# EAGLE design 7 segment driver (EAGLE 5.12)
DATABASE: ../../partsdb.txt
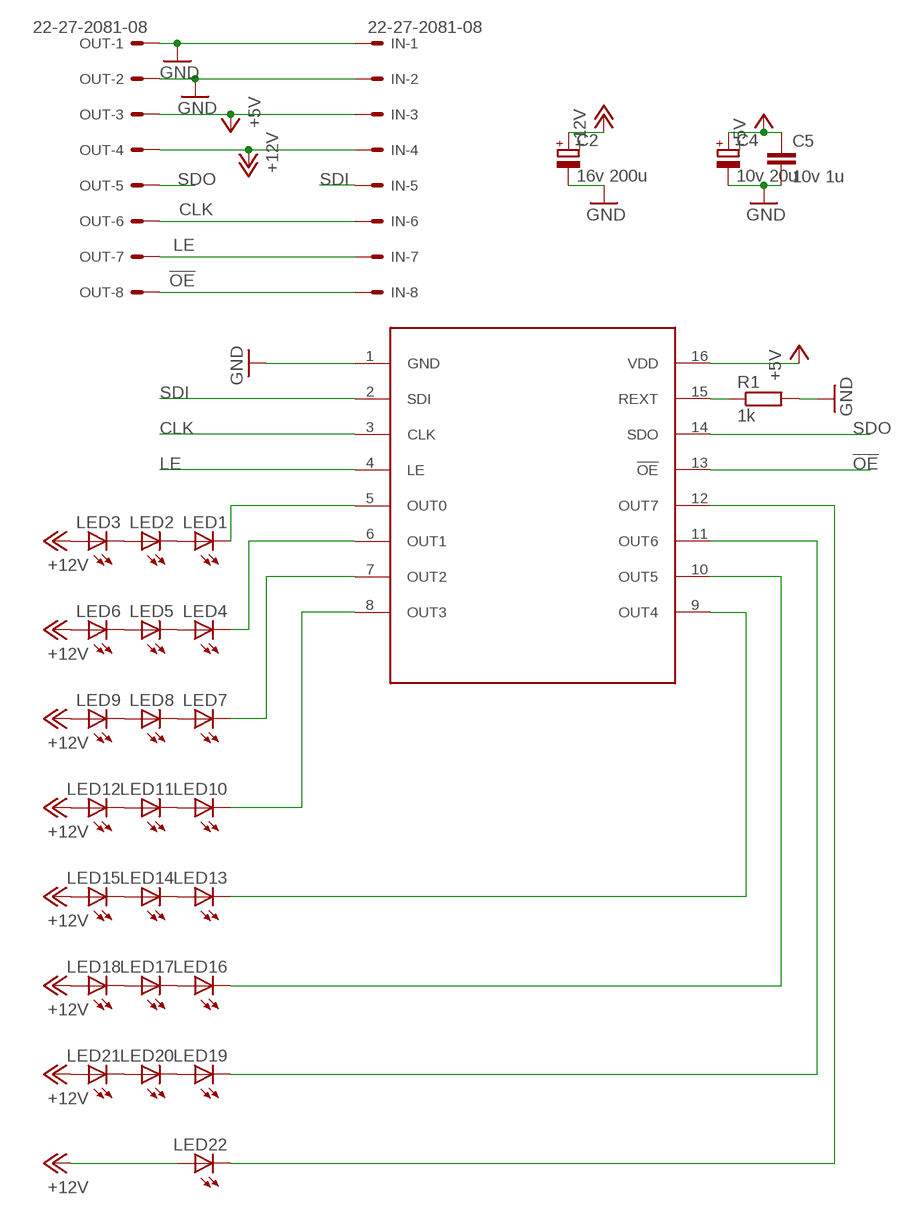
[diagram p0: schematic, sheet 1]

## Parts
C2  16v 200u  CPOL-EUE5-6  [E5-6]
C4  10v 20u  CPOL-EUE1.8-4  [E1,8-4]
C5  10v 1u  C-EU025-025X050  [C025-025X050]
IC1  TLC5916  [DIL16]
IN  22-27-2081-08  [6410-08]
LED1  LED10MM  [LED10MM]
LED2  LED10MM  [LED10MM]
LED3  LED10MM  [LED10MM]
LED4  LED10MM  [LED10MM]
LED5  LED10MM  [LED10MM]
LED6  LED10MM  [LED10MM]
LED7  LED10MM  [LED10MM]
LED8  LED10MM  [LED10MM]
LED9  LED10MM  [LED10MM]
LED10  LED10MM  [LED10MM]
LED11  LED10MM  [LED10MM]
LED12  LED10MM  [LED10MM]
LED13  LED10MM  [LED10MM]
LED14  LED10MM  [LED10MM]
LED15  LED10MM  [LED10MM]
LED16  LED10MM  [LED10MM]
LED17  LED10MM  [LED10MM]
LED18  LED10MM  [LED10MM]
LED19  LED10MM  [LED10MM]
LED20  LED10MM  [LED10MM]
LED21  LED10MM  [LED10MM]
LED22  LED10MM  [LED10MM]
OUT  22-27-2081-08  [6410-08]
R1  1k  R-EU_0207/10  [0207/10]

## Nets
!OE: IC1.13(!OE) IN.8 OUT.8
+5V [power]: C4.+ C5.1 IC1.16(VDD) IN.3 OUT.3
+12V [power]: C2.+ IN.4 LED3.A LED6.A LED9.A LED12.A LED15.A LED18.A LED21.A LED22.A OUT.4
CLK: IC1.3(CLK) IN.6 OUT.6
GND [power]: C2.- C4.- C5.2 IC1.1(GND) IN.1 IN.2 OUT.1 OUT.2 R1.2
LE: IC1.4(LE) IN.7 OUT.7
N$1: LED1.A LED2.K(C)
N$2: LED2.A LED3.K(C)
N$3: LED4.A LED5.K(C)
N$4: LED5.A LED6.K(C)
N$5: LED7.A LED8.K(C)
N$6: LED8.A LED9.K(C)
N$7: LED10.A LED11.K(C)
N$8: LED11.A LED12.K(C)
N$9: LED13.A LED14.K(C)
N$10: LED14.A LED15.K(C)
N$11: LED16.A LED17.K(C)
N$12: LED17.A LED18.K(C)
N$13: LED19.A LED20.K(C)
N$14: LED20.A LED21.K(C)
N$15: IC1.5(OUT0) LED1.K(C)
N$16: IC1.6(OUT1) LED4.K(C)
N$17: IC1.7(OUT2) LED7.K(C)
N$18: IC1.8(OUT3) LED10.K(C)
N$19: IC1.9(OUT4) LED13.K(C)
N$20: IC1.10(OUT5) LED16.K(C)
N$21: IC1.11(OUT6) LED19.K(C)
N$22: IC1.12(OUT7) LED22.K(C)
N$23: IC1.15(REXT) R1.1
SDI: IC1.2(SDI) IN.5
SDO: IC1.14(SDO) OUT.5

## Library data of the parts
C2 C4 = matt rcl:CPOL-EU: POLARIZED CAPACITOR, European symbol
C5 = matt rcl:C-EU: CAPACITOR, European symbol
IC1 = matt:TLC5916
IN OUT = con-molex:22-?-08: CONNECTOR wire to board 2.54 mm (.1 inch) pitch header; OC_FARNELL: unknown; OC_NEWARK: unknown
LED1-LED22 = led:LED: LED OSRAM: - CHIPLED LG R971, LG N971, LY N971, LG Q971, LY Q971, LO R971, LY R971 LH N974, LH R974 LS Q976, LO Q976, LY Q976 LO Q996 - Hyper CHIPLED LW Q18S LB Q993, LB Q99A, LB R99A - SideLED LS A670, LO A670, LY A670, LG A670, LP A670 LB A673, LV A673, LT A673, LW A673 LH A674 LY A675 LS A676, LA A676, LO A676, LY A676, LW A676 LS A679, LY A679, LG A679 - Hyper Micro SIDELED® LS Y876, LA Y876, LO Y876, LY Y876 LT Y87S - SmartLED LW L88C, LW L88S LB L89C, LB L89S, LG L890 LS L89K, LO L89K, LY L89K LS L896, LA L896, LO L896, LY L896 - TOPLED LS T670, LO T670, LY T670, LG T670, LP T670 LSG T670, LSP T670, LSY T670, LOP T670, LYG T670 LG T671, LOG T671, LSG T671 LB T673, LV T673, LT T673, LW T673 LH T674 LS T676, LA T676, LO T676, LY T676, LB T676, LH T676, LSB T676, LW T676 LB T67C, LV T67C, LT T67C, LS T67K, LO T67K, LY T67K, LW E67C LS E67B, LA E67B, LO E67B, LY E67B, LB E67C, LV E67C, LT E67C LW T67C LS T679, LY T679, LG T679 LS T770, LO T770, LY T770, LG T770, LP T770 LB T773, LV T773, LT T773, LW T773 LH T774 LS E675, LA E675, LY E675, LS T675 LS T776, LA T776, LO T776, LY T776, LB T776 LHGB T686 LT T68C, LB T68C - Hyper Mini TOPLED® LB M676 - Mini TOPLED Santana® LG M470 LS M47K, LO M47K, LY M47K Source: http://www.osram.convergy.de LUXEON: - LUMILED® LXK2-PW12-R00, LXK2-PW12-S00, LXK2-PW14-U00, LXK2-PW14-V00 LXK2-PM12-R00, LXK2-PM12-S00, LXK2-PM14-U00 LXK2-PE12-Q00, LXK2-PE12-R00, LXK2-PE12-S00, LXK2-PE14-T00, LXK2-PE14-U00 LXK2-PB12-K00, LXK2-PB12-L00, LXK2-PB12-M00, LXK2-PB14-N00, LXK2-PB14-P00, LXK2-PB14-Q00 LXK2-PR12-L00, LXK2-PR12-M00, LXK2-PR14-Q00, LXK2-PR14-R00 LXK2-PD12-Q00, LXK2-PD12-R00, LXK2-PD12-S00 LXK2-PH12-R00, LXK2-PH12-S00 LXK2-PL12-P00, LXK2-PL12-Q00, LXK2-PL12-R00 Source: www.luxeon.com KINGBRIGHT: KA-3528ASYC Source: www.kingbright.com
R1 = matt rcl:R-EU_: RESISTOR, European symbol

## Net classes
1 power: width 0.508 mm

## Board
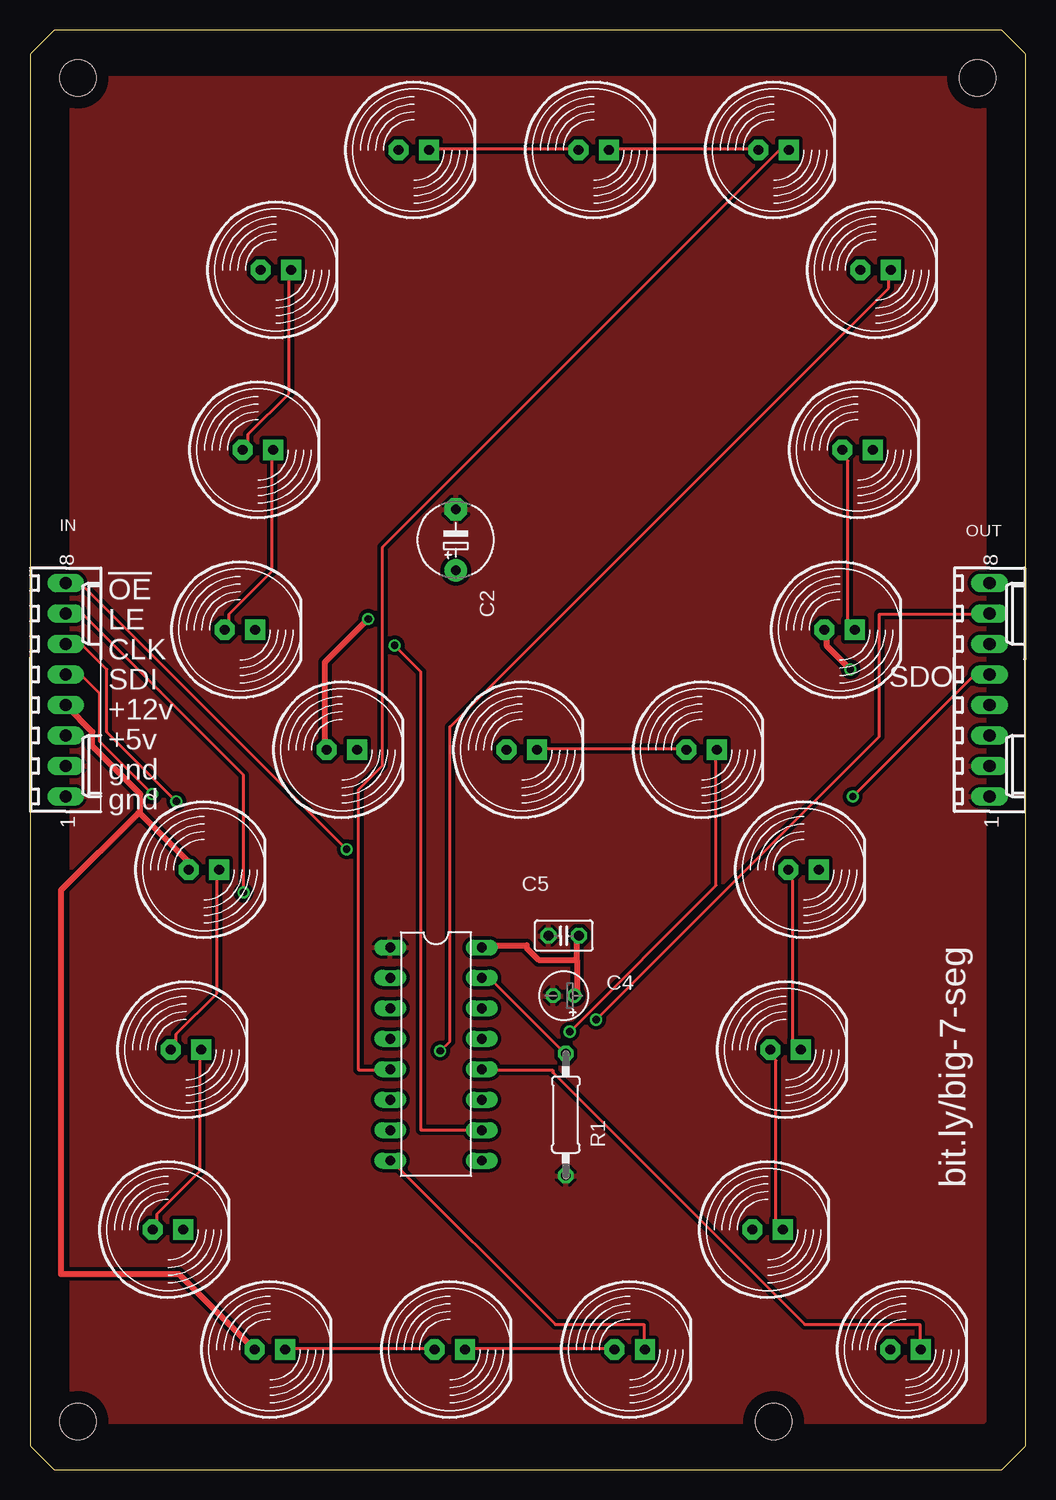
[diagram p1: board, top side]
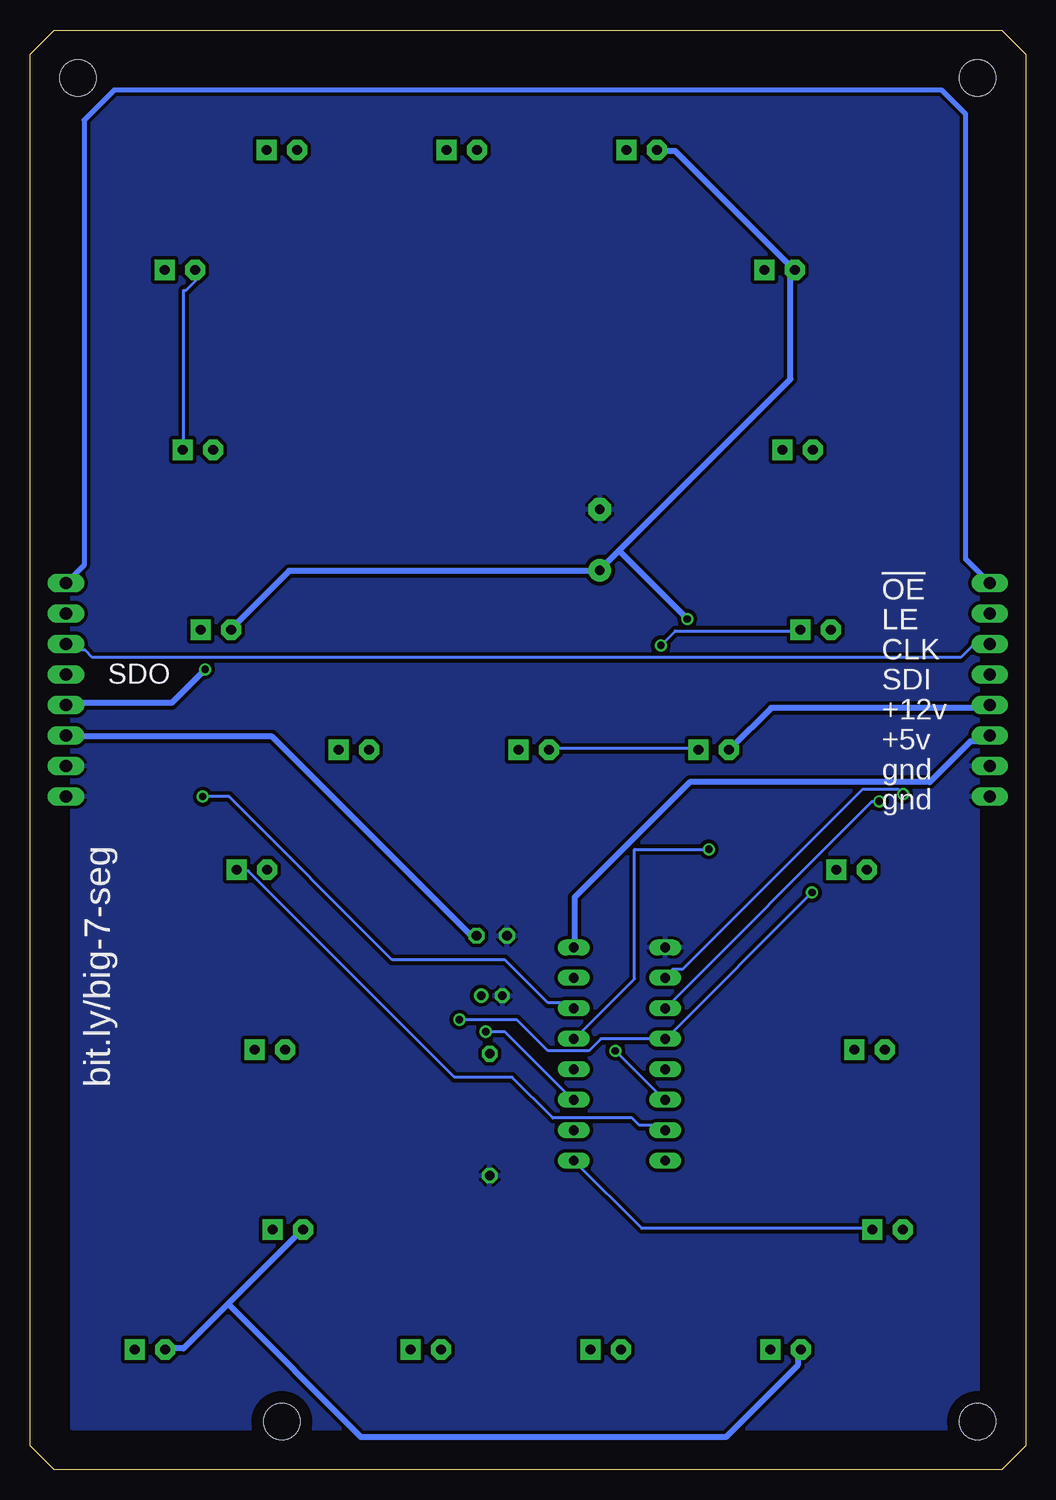
[diagram p2: board, bottom side, seen from below]

Size 83 x 120 mm. Coordinates in mm from the lower left corner, seen from the top.
Outline: 81,0 83,2 83,118 81,120 2,120 0,118 0,2 2,0 81,0
Copper layers (1*16): Top 0.035mm / dielectric 1.5mm / Bottom 0.035mm
Design rules "default": minimum track width 10mil, minimum drill 24mil, track to track 8mil, track to pad 8mil, pad to pad 8mil, via to via 8mil, smd to smd 8mil, copper to edge 40mil, drill to drill 8mil, minimum pad ring 10mil, minimum via ring 8mil, stop-mask expansion 4mil, vias tented up to drill 0mil, thermal gap 10mil
Holes 3 mm at 4,4 62,4 4,116 79,116

### Footprints (pad centres in the part's own frame; a part is rotated, then mirrored left to right if it is on the bottom)
E5-6 = drill 0.813 pad 1.905 round: + -2.54,0 | drill 0.813 pad 1.905 octagon: - 2.54,0
E1,8-4 = drill 0.711 pad 1.168 round: + -0.889,0 | drill 0.711 pad 1.168 octagon: - 0.889,0
C025-025X050 = drill 0.813 octagon: 1 -1.27,0; 2 1.27,0
DIL16 = drill 0.813 long: 1 -8.89,-3.81; 2 -6.35,-3.81; 3 -3.81,-3.81; 4 -1.27,-3.81; 5 1.27,-3.81; 6 3.81,-3.81; 7 6.35,-3.81; 8 8.89,-3.81; 9 8.89,3.81; 10 6.35,3.81; 11 3.81,3.81; 12 1.27,3.81; 13 -1.27,3.81; 14 -3.81,3.81; 15 -6.35,3.81; 16 -8.89,3.81
6410-08 = drill 1.016 long: 1 8.89,0; 2 6.35,0; 3 3.81,0; 4 1.27,0; 5 -1.27,0; 6 -3.81,0; 7 -6.35,0; 8 -8.89,0
LED10MM = drill 0.813 pad 1.676 octagon: A -1.27,0 | drill 0.813 pad 1.676 square: K 1.27,0
0207/10 = drill 0.813 octagon: 1 -5.08,0; 2 5.08,0

### Placement (x,y rotation side)
C2  35.5,77.5 90 top
C4  44.5,39.5 180 top
C5  44.5,44.5 180 top
IC1  33.85,34.63 270 top
IN  2.98,65 270 top
LED1  62,110 0 top
LED2  47,110 0 top
LED3  32,110 0 top
LED4  70.5,100 0 top
LED5  69,85 0 top
LED6  67.5,70 0 top
LED7  64.5,50 0 top
LED8  63,35 0 top
LED9  61.5,20 0 top
LED10  50,10 0 top
LED11  35,10 0 top
LED12  20,10 0 top
LED13  11.5,20 0 top
LED14  13,35 0 top
LED15  14.5,50 0 top
LED16  17.5,70 0 top
LED17  19,85 0 top
LED18  20.5,100 0 top
LED19  56,60 0 top
LED20  41,60 0 top
LED21  26,60 0 top
LED22  73,10 0 top
OUT  80,65 270 top
R1  44.67,29.58 270 top
U$2  [OPENHARDWARELOGO]  53.5,80 90 top

### Tracks (layer width: path | path; a pad name or v marks a point on that pad's centre or on a via)
!OE  (via drill 0.61)
  Top 0.254: v26.4,51.7 4.4,73.7 3,73.7 IN.8
  Bottom 0.254: v26.4,51.7 32.6,51.7 32.6,40.9 37.6,35.9 IC1.13
  Bottom 0.406: IN.8 3,73.89 5,75.89 5,113 7,115 76,115 78.5,112.5 78.5,75.39 OUT.8
+5V
  Top 0.508: 45.6,42.5 45.6,44.5 C5.1 | 45.6,42.5 45.6,39.7 C4.+ | IC1.16 37.8,43.7 41.4,43.7 41.4,43.5 42.4,42.5 45.6,42.5
  Bottom 0.508: IN.3 3,61.1 3.4,60.7 4.6,60.7 8,57.3 28,57.3 37.6,47.7 37.6,43.7 IC1.16 | OUT.3 80,61.1 62.8,61.1 46.2,44.5 C5.1
+12V  (via drill 0.61)
  Top 0.508: v68.4,66.7 66.4,68.7 66.4,69.9 LED6.A | 9.2,54.7 9.2,56.3 5.2,60.3 5.2,61.5 3,63.7 IN.4 | 9.2,54.7 13.2,50.7 13.2,50.1 LED15.A | LED12.A 18.6,10.1 12.4,16.3 2.6,16.3 2.6,48.3 9,54.7 9.2,54.7 | v28.2,70.9 24.6,67.3 24.6,60.1 LED21.A
  Bottom 0.508: v68.4,66.7 71.2,63.9 80,63.9 OUT.4 | LED3.A 30.6,109.9 29.2,109.9 19.4,100.1 LED18.A 19.4,99.9 19.6,99.9 19.6,90.9 33.9,76.6 | 33.9,76.6 35.4,75.1 C2.+ 35.6,74.9 61.4,74.9 66.2,70.1 LED6.A | 66.5,13.8 70.2,10.1 71.6,10.1 LED22.A | 66.5,13.8 60.4,19.9 LED9.A | LED21.A 24.6,60.1 21.2,63.5 4.4,63.5 4.2,63.7 3,63.7 IN.4 | 66.5,13.8 55.4,2.7 25,2.7 19,8.7 19,9.9 18.8,9.9 LED12.A | v28.2,70.9 33.9,76.6
CLK  (via drill 0.61)
  Top 0.254: v12.2,55.7 6.4,61.5 6.4,66.7 4.4,68.7 3,68.7 IN.6
  Bottom 0.254: v12.2,55.7 12.8,55.7 30,38.5 IC1.3 | OUT.6 80,68.7 79.6,68.3 78.4,68.3 77.8,67.7 5.4,67.7 4.4,68.7 3,68.7 IN.6
GND
  pour Top (isolate 0.305): 3.5,116 79.5,116 79.5,4 3.5,4
  pour Bottom (isolate 0.305): 4,116 79.5,116 79.5,3.5 4,3.5
LE  (via drill 0.61)
  Top 0.254: v17.8,48.1 17.8,57.9 4.4,71.3 3,71.3 IN.7 | v47.2,37.5 70.8,61.1 70.8,71.3 80,71.3 OUT.7
  Bottom 0.254: v17.8,48.1 30,35.9 IC1.4 35.4,35.9 36.4,34.9 39.8,34.9 42.4,37.5 v47.2,37.5
N$1
  Top 0.254: LED2.K 48.4,110.1 60.6,110.1 LED1.A
N$2
  Top 0.254: LED3.K 33.4,110.1 45.6,110.1 LED2.A
N$3
  Bottom 0.254: LED5.K 70.2,85.1 70.2,98.3 70,98.3 69.2,99.1 69.2,99.9 LED4.A
N$4
  Top 0.254: LED6.K 68.6,70.1 68.2,70.5 68.2,84.1 67.8,84.5 67.8,84.9 LED5.A
N$5
  Top 0.254: LED8.K 64.2,35.1 63.6,35.7 63.6,49.1 63.4,49.3 63.4,49.9 LED7.A
N$6
  Top 0.254: LED9.K 62.6,20.1 62.2,20.5 62.2,34.1 61.8,34.5 61.8,34.9 LED8.A
N$7
  Top 0.254: LED11.K 36.4,10.1 48.6,10.1 LED10.A
N$8
  Top 0.254: LED12.K 21.4,10.1 33.6,10.1 LED11.A
N$9
  Top 0.254: LED13.A 10.4,20.1 10.6,20.3 10.6,21.3 14.2,24.9 14.2,34.9 LED14.K
N$10
  Top 0.254: LED14.A 11.8,35.1 12.2,35.5 12.2,36.3 15.6,39.7 15.6,49.9 LED15.K
N$11
  Top 0.254: LED16.A 16.4,70.1 16.6,70.3 16.6,71.3 20.2,74.9 20.2,84.9 LED17.K
N$12
  Top 0.254: LED17.A 17.8,85.1 18.2,85.5 18.2,86.3 21.6,89.7 21.6,99.9 LED18.K
N$13
  Top 0.254: LED20.K 42.4,60.1 54.6,60.1 LED19.A
N$14
  Bottom 0.254: LED21.K 27.4,60.1 39.6,60.1 LED20.A
N$15
  Top 0.254: IC1.5 30,33.3 27.4,33.3 27.4,56.7 29.4,58.7 29.4,76.9 62.4,109.9 63.2,109.9 LED1.K
N$16  (via drill 0.61)
  Top 0.254: v34.2,34.9 35,35.7 35,61.9 71.6,98.5 71.6,99.9 LED4.K
  Bottom 0.254: v34.2,34.9 30.2,30.9 IC1.6
N$17
  Bottom 0.254: IC1.7 30.2,28.3 30.6,28.7 32.2,28.7 32.8,29.3 39.4,29.3 42.8,32.7 47.6,32.7 64.8,49.9 65.6,49.9 LED7.K
N$18
  Top 0.254: IC1.8 30.2,25.7 43.8,12.1 51.2,12.1 51.2,10.1 LED10.K
N$19
  Bottom 0.254: IC1.9 37.6,25.7 32,20.1 12.8,20.1 LED13.K
N$20  (via drill 0.61)
  Top 0.254: v30.4,68.7 32.6,66.5 32.6,28.3 37.6,28.3 IC1.10
  Bottom 0.254: v30.4,68.7 29.2,69.9 18.8,69.9 LED16.K
N$21  (via drill 0.61)
  Top 0.254: v45,36.5 57.2,48.7 57.2,59.9 LED19.K
  Bottom 0.254: v45,36.5 43.4,36.5 37.8,30.9 IC1.11
N$22
  Top 0.254: IC1.12 37.8,33.3 43.6,33.3 43.6,33.1 64.6,12.1 74.2,12.1 74.2,10.1 LED22.K
N$23
  Top 0.254: R1.1 44.6,34.7 38.4,40.9 37.8,40.9 IC1.15
SDI  (via drill 0.61)
  Top 0.254: v10.2,56.3 5.8,60.7 5.8,64.7 4.4,66.1 3,66.1 IN.5
  Bottom 0.254: v10.2,56.3 10.6,56.7 13.6,56.7 28.6,41.7 29.4,41.7 30,41.1 IC1.2
SDO  (via drill 0.61)
  Top 0.254: v68.6,56.1 78.6,66.1 80,66.1 OUT.5
  Bottom 0.254: v68.6,56.1 66.4,56.1 52.8,42.5 43.4,42.5 39.8,38.9 38.2,38.9 37.8,38.5 IC1.14

### Text on the board
tNames: !OE | LE | CLK | SDO | SDI | +12v | +5v | gnd | gnd | bit.ly/big-7-seg
bNames: !OE | LE | CLK | SDI | SDO | +12v | +5v | gnd | gnd | bit.ly/big-7-seg